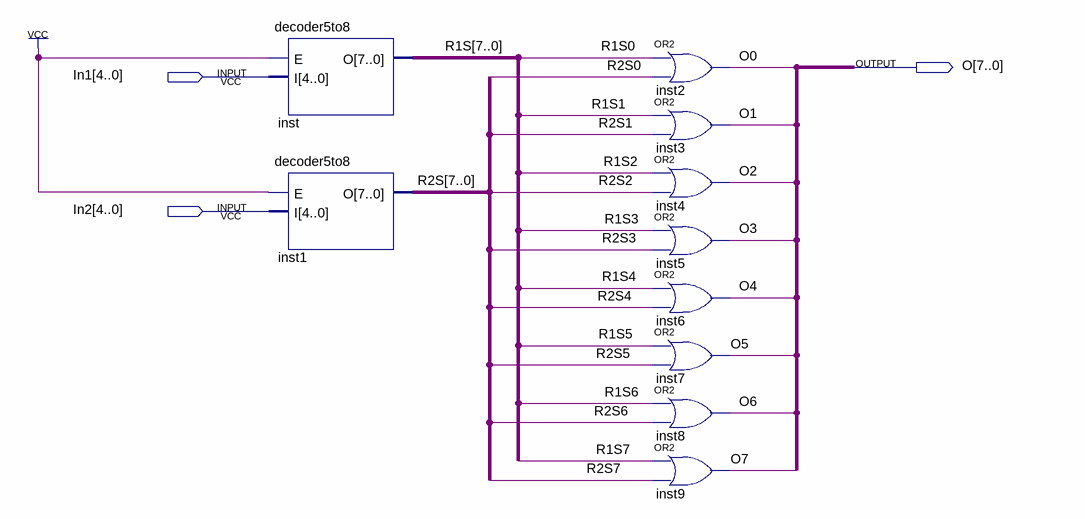
[diagram p0: schematic sheet]
// Quartus schematic ReadSelect.bdf as structural Verilog: 10 symbols, 3 pins
module ReadSelect (
  input  [4:0] In1,
  input  [4:0] In2,
  output [7:0] O
);

  wire [7:0] R1S, R2S;

  decoder5to8 inst (.E(1'b1), .I(In1), .O(R1S));
  decoder5to8 inst1 (.E(1'b1), .I(In2), .O(R2S));
  or inst2 (O[0], R1S[0], R2S[0]);
  or inst3 (O[1], R1S[1], R2S[1]);
  or inst4 (O[2], R1S[2], R2S[2]);
  or inst5 (O[3], R1S[3], R2S[3]);
  or inst6 (O[4], R1S[4], R2S[4]);
  or inst7 (O[5], R1S[5], R2S[5]);
  or inst8 (O[6], R1S[6], R2S[6]);
  or inst9 (O[7], R1S[7], R2S[7]);
endmodule
